# EAGLE design avrkitOnly (EAGLE 9.3.0)
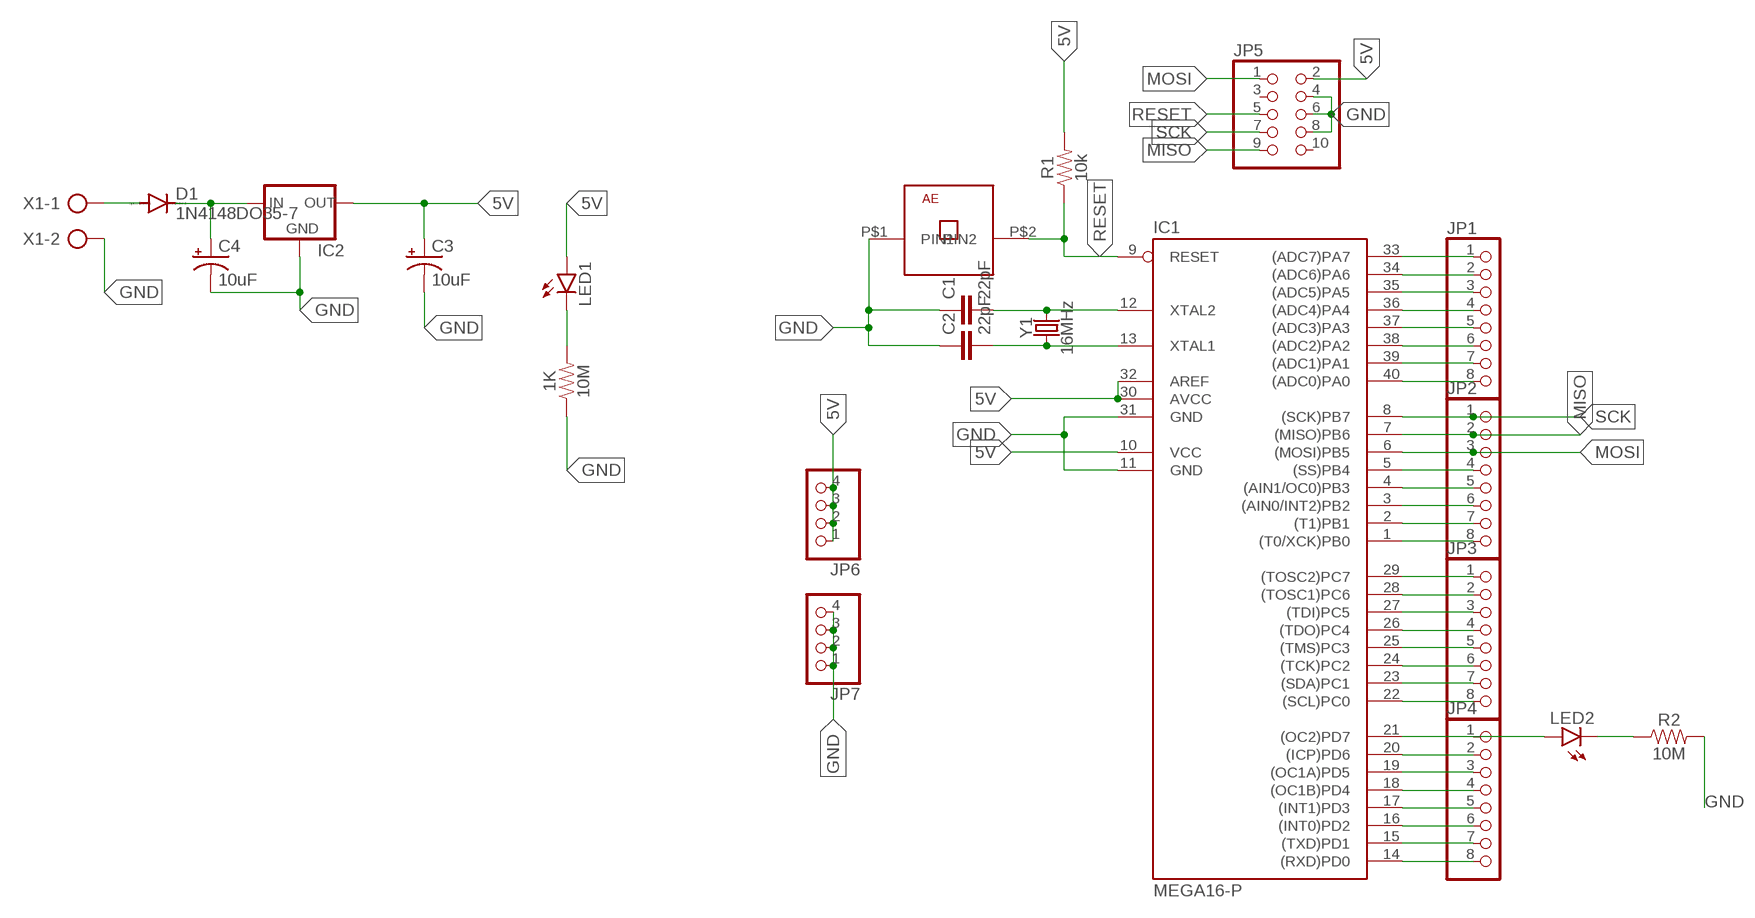
[diagram p0: schematic, sheet 1]

## Parts
1K  10M  10MOHM-HORIZ-1/4W-5%  [AXIAL-0.3]
C1  22pF  22PF-PTH-2.54MM-200V-5%  [CAP-PTH-2.54]
C2  22pF  22PF-PTH-2.54MM-200V-5%  [CAP-PTH-2.54]
C3  10uF  10UF-POLAR-RADIAL-2.5MM-25V-20%  [CPOL-RADIAL-2.5MM-5MM]
C4  10uF  10UF-POLAR-RADIAL-2.5MM-25V-20%  [CPOL-RADIAL-2.5MM-5MM]
D1  1N4148DO35-7  [DO35-7]
IC1  MEGA16-P  [DIL40]
IC2  78XXS  [78XXS]
JP1  PINHD-1X8  [1X08]
JP2  PINHD-1X8  [1X08]
JP3  PINHD-1X8  [1X08]
JP4  PINHD-1X8  [1X08]
JP5  PINHD-2X5  [2X05]
JP6  PINHD-1X4  [1X04]
JP7  PINHD-1X4  [1X04]
LED1  LED3MM  [LED3MM]
LED2  LED3MM  [LED3MM]
R1  10k  10MOHM-HORIZ-1/4W-5%  [AXIAL-0.3]
R2  10M  10MOHM-HORIZ-1/4W-5%  [AXIAL-0.3]
U$1  PUSHBUTTON-AE  [PUSHBUTTON-AE]
X1  AK500/2-H  [AK500/2-H]
Y1  16MHz  CRYSTAL-16MHZPTH-HC49US  [HC49US]

## Nets
5V: C3.1(+) IC1.10(VCC) IC1.30(AVCC) IC1.32(AREF) IC2.OUT JP5.2 JP6.1 JP6.2 JP6.3 JP6.4 LED1.A R1.P$2
GND: 1K.P$1 C1.1 C2.1 C3.2(-) C4.2(-) IC1.11(GND) IC1.31(GND) IC2.GND JP5.4 JP5.6 JP5.8 JP7.1 JP7.2 JP7.3 JP7.4 R2.P$2 U$1.P$1(PIN1) X1.2
MISO: IC1.7((MISO)PB6) JP2.2 JP5.9
MOSI: IC1.6((MOSI)PB5) JP2.3 JP5.1
N$1: C1.2 IC1.12(XTAL2) Y1.2
N$2: C2.2 IC1.13(XTAL1) Y1.1
N$3: C4.1(+) D1.C IC2.IN
N$4: 1K.P$2 LED1.K(C)
N$5: LED2.K(C) R2.P$1
N$6: D1.A X1.1
N$7: IC1.33((ADC7)PA7) JP1.1
N$8: IC1.34((ADC6)PA6) JP1.2
N$9: IC1.35((ADC5)PA5) JP1.3
N$10: IC1.36((ADC4)PA4) JP1.4
N$11: IC1.37((ADC3)PA3) JP1.5
N$12: IC1.38((ADC2)PA2) JP1.6
N$13: IC1.39((ADC1)PA1) JP1.7
N$14: IC1.40((ADC0)PA0) JP1.8
N$18: IC1.5((SS)PB4) JP2.4
N$19: IC1.4((AIN1/OC0)PB3) JP2.5
N$20: IC1.3((AIN0/INT2)PB2) JP2.6
N$21: IC1.2((T1)PB1) JP2.7
N$22: IC1.1((T0/XCK)PB0) JP2.8
N$23: IC1.29((TOSC2)PC7) JP3.1
N$24: IC1.28((TOSC1)PC6) JP3.2
N$25: IC1.27((TDI)PC5) JP3.3
N$26: IC1.26((TDO)PC4) JP3.4
N$27: IC1.25((TMS)PC3) JP3.5
N$28: IC1.24((TCK)PC2) JP3.6
N$29: IC1.23((SDA)PC1) JP3.7
N$30: IC1.22((SCL)PC0) JP3.8
N$31: IC1.21((OC2)PD7) JP4.1 LED2.A
N$32: IC1.20((ICP)PD6) JP4.2
N$33: IC1.19((OC1A)PD5) JP4.3
N$34: IC1.18((OC1B)PD4) JP4.4
N$35: IC1.17((INT1)PD3) JP4.5
N$36: IC1.16((INT0)PD2) JP4.6
N$37: IC1.15((TXD)PD1) JP4.7
N$38: IC1.14((RXD)PD0) JP4.8
RESET: IC1.9(RESET) JP5.5 R1.P$1 U$1.P$2(PIN2)
SCK: IC1.8((SCK)PB7) JP2.1 JP5.7
Unconnected: JP5.3 JP5.10

## Library data of the parts
1K R2 = SparkFun-Resistors:10MOHM: RES-09327; PROD_ID: RES-09327
C1 C2 = SparkFun-Capacitors:22PF: 22pF ceramic capacitors A capacitor is a passive two-terminal electrical component used to store electrical energy temporarily in an electric field.; PROD_ID: CAP-09128
C3 C4 = SparkFun-Capacitors:10UF-POLAR: 10.0µF polarized capacitors A capacitor is a passive two-terminal electrical component used to store electrical energy temporarily in an electric field.; PROD_ID: CAP-08440
D1 = diode:1N4148: DIODE high speed (Philips)
IC1 = atmel:MEGA16-P: MICROCONTROLLER 16 Kbytes FLASH 1 kbytes SRAM 512 bytes EEPROM USART 8-channel 10 bit ADC Source: avr.lbr; MPN: ATMEGA16-16PU; OC_FARNELL: 9171142; OC_NEWARK: 01M6885
IC2 = v-reg:78XXS: VOLTAGE REGULATOR
JP1-JP4 = pinhead:PINHD-1X8: PIN HEADER
JP5 = pinhead:PINHD-2X5: PIN HEADER
JP6 JP7 = pinhead:PINHD-1X4: PIN HEADER
LED1 LED2 = led:LED: LED OSRAM: - CHIPLED LG R971, LG N971, LY N971, LG Q971, LY Q971, LO R971, LY R971 LH N974, LH R974 LS Q976, LO Q976, LY Q976 LO Q996 - Hyper CHIPLED LW Q18S LB Q993, LB Q99A, LB R99A - SideLED LS A670, LO A670, LY A670, LG A670, LP A670 LB A673, LV A673, LT A673, LW A673 LH A674 LY A675 LS A676, LA A676, LO A676, LY A676, LW A676 LS A679, LY A679, LG A679 - Hyper Micro SIDELED® LS Y876, LA Y876, LO Y876, LY Y876 LT Y87S - SmartLED LW L88C, LW L88S LB L89C, LB L89S, LG L890 LS L89K, LO L89K, LY L89K LS L896, LA L896, LO L896, LY L896 - TOPLED LS T670, LO T670, LY T670, LG T670, LP T670 LSG T670, LSP T670, LSY T670, LOP T670, LYG T670 LG T671, LOG T671, LSG T671 LB T673, LV T673, LT T673, LW T673 LH T674 LS T676, LA T676, LO T676, LY T676, LB T676, LH T676, LSB T676, LW T676 LB T67C, LV T67C, LT T67C, LS T67K, LO T67K, LY T67K, LW E67C LS E67B, LA E67B, LO E67B, LY E67B, LB E67C, LV E67C, LT E67C LW T67C LS T679, LY T679, LG T679 LS T770, LO T770, LY T770, LG T770, LP T770 LB T773, LV T773, LT T773, LW T773 LH T774 LS E675, LA E675, LY E675, LS T675 LS T776, LA T776, LO T776, LY T776, LB T776 LHGB T686 LT T68C, LB T68C - Hyper Mini TOPLED® LB M676 - Mini TOPLED Santana® LG M470 LS M47K, LO M47K, LY M47K Source: http://www.osram.convergy.de LUXEON: - LUMILED® LXK2-PW12-R00, LXK2-PW12-S00, LXK2-PW14-U00, LXK2-PW14-V00 LXK2-PM12-R00, LXK2-PM12-S00, LXK2-PM14-U00 LXK2-PE12-Q00, LXK2-PE12-R00, LXK2-PE12-S00, LXK2-PE14-T00, LXK2-PE14-U00 LXK2-PB12-K00, LXK2-PB12-L00, LXK2-PB12-M00, LXK2-PB14-N00, LXK2-PB14-P00, LXK2-PB14-Q00 LXK2-PR12-L00, LXK2-PR12-M00, LXK2-PR14-Q00, LXK2-PR14-R00 LXK2-PD12-Q00, LXK2-PD12-R00, LXK2-PD12-S00 LXK2-PH12-R00, LXK2-PH12-S00 LXK2-PL12-P00, LXK2-PL12-Q00, LXK2-PL12-R00 Source: www.luxeon.com KINGBRIGHT: KA-3528ASYC Source: www.kingbright.com
R1 = SparkFun-Resistors:10MOHM: RES-09327; PROD_ID: RES-09327; VALUE: 10M
U$1 = PushButton-AE:PUSHBUTTON-AE: This is 2 pin push button designed by the one and only Alaa Essam وماعندناش داتا شيت ان كان عاجبك
X1 = con-ptr500:AK500/2-H: CONNECTOR Aug. 2004 / PTR Meßtechnik: Die Bezeichnung der Serie AK505 wurde geändert. Es handelt sich hierbei um AK500 in horizontaler Ausführung.; OC_FARNELL: unknown; OC_NEWARK: unknown
Y1 = SparkFun-Clocks:CRYSTAL-16MHZ: 16MHz Crystal Digikey Example <http://www.digikey.com/product-search/en?keywords=535-9122-1-ND> Frequency: 16MHz Frequency Stability: ±50ppm Frequency Tolerance: ±20ppm Load Capacitance: 18pF SparkFun Products: Pro Micro -5V/16MHz <https://www.sparkfun.com/products/12640> SparkFun Serial Enabled LCD Kit <https://www.sparkfun.com/products/10097>; PROD_ID: XTAL-08181; SF_ID: COM-00536

## Board
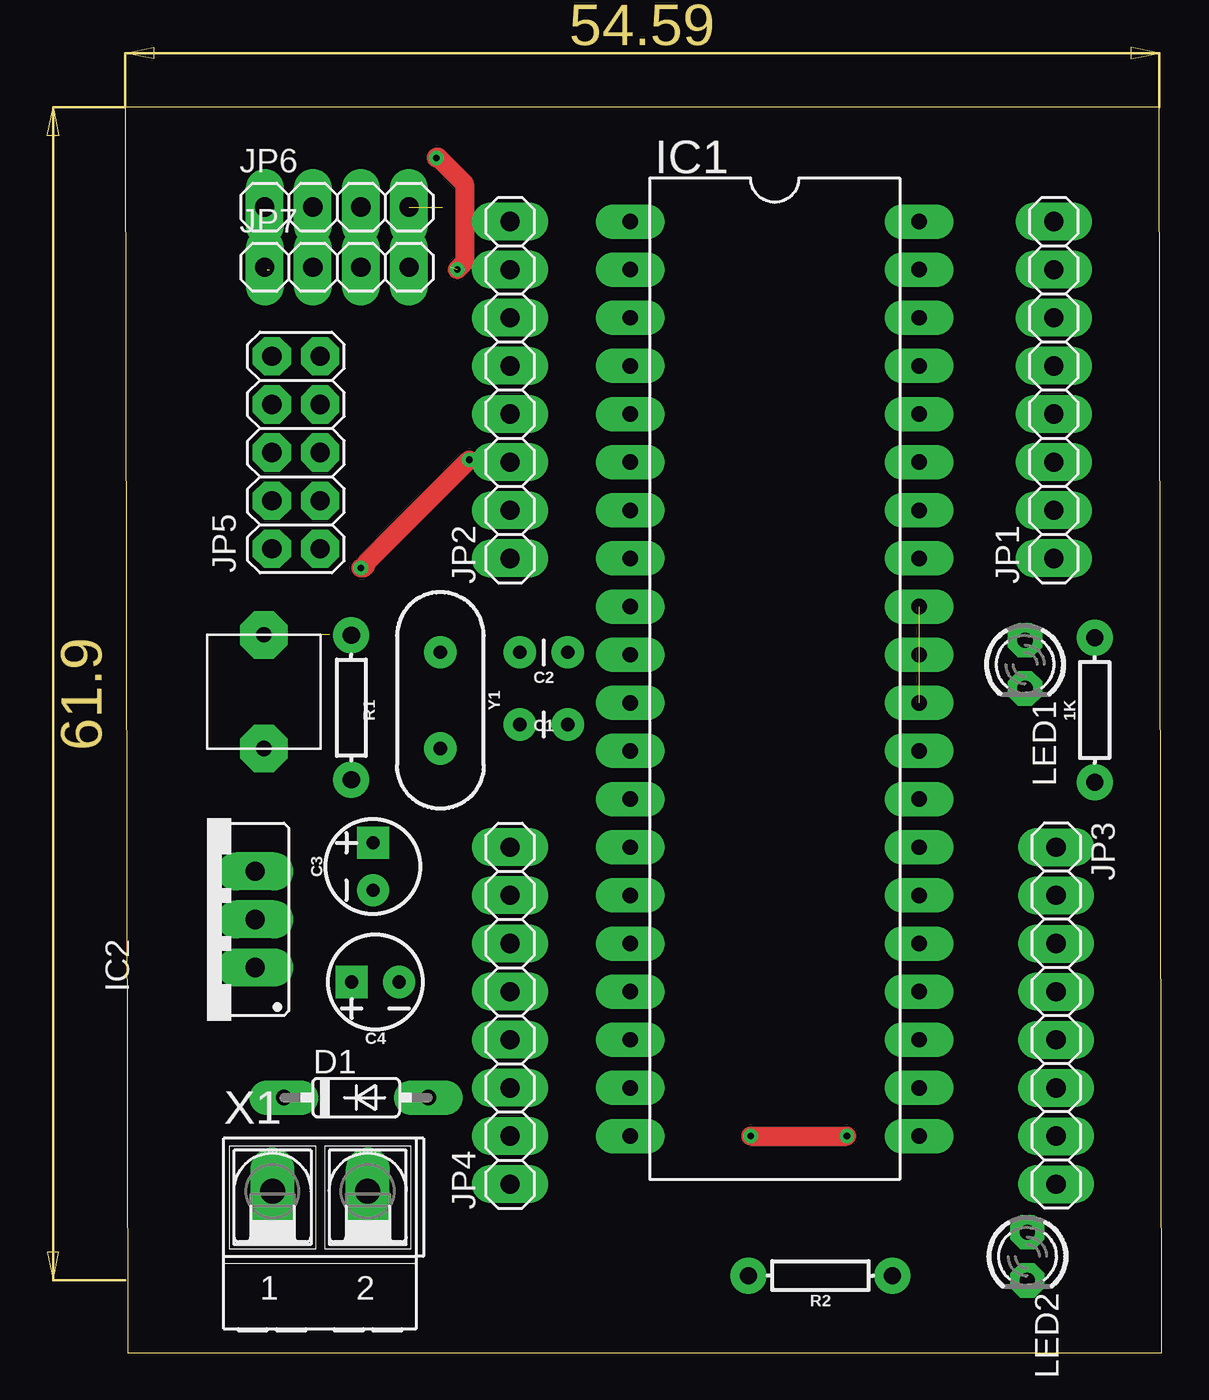
[diagram p1: board, top side]
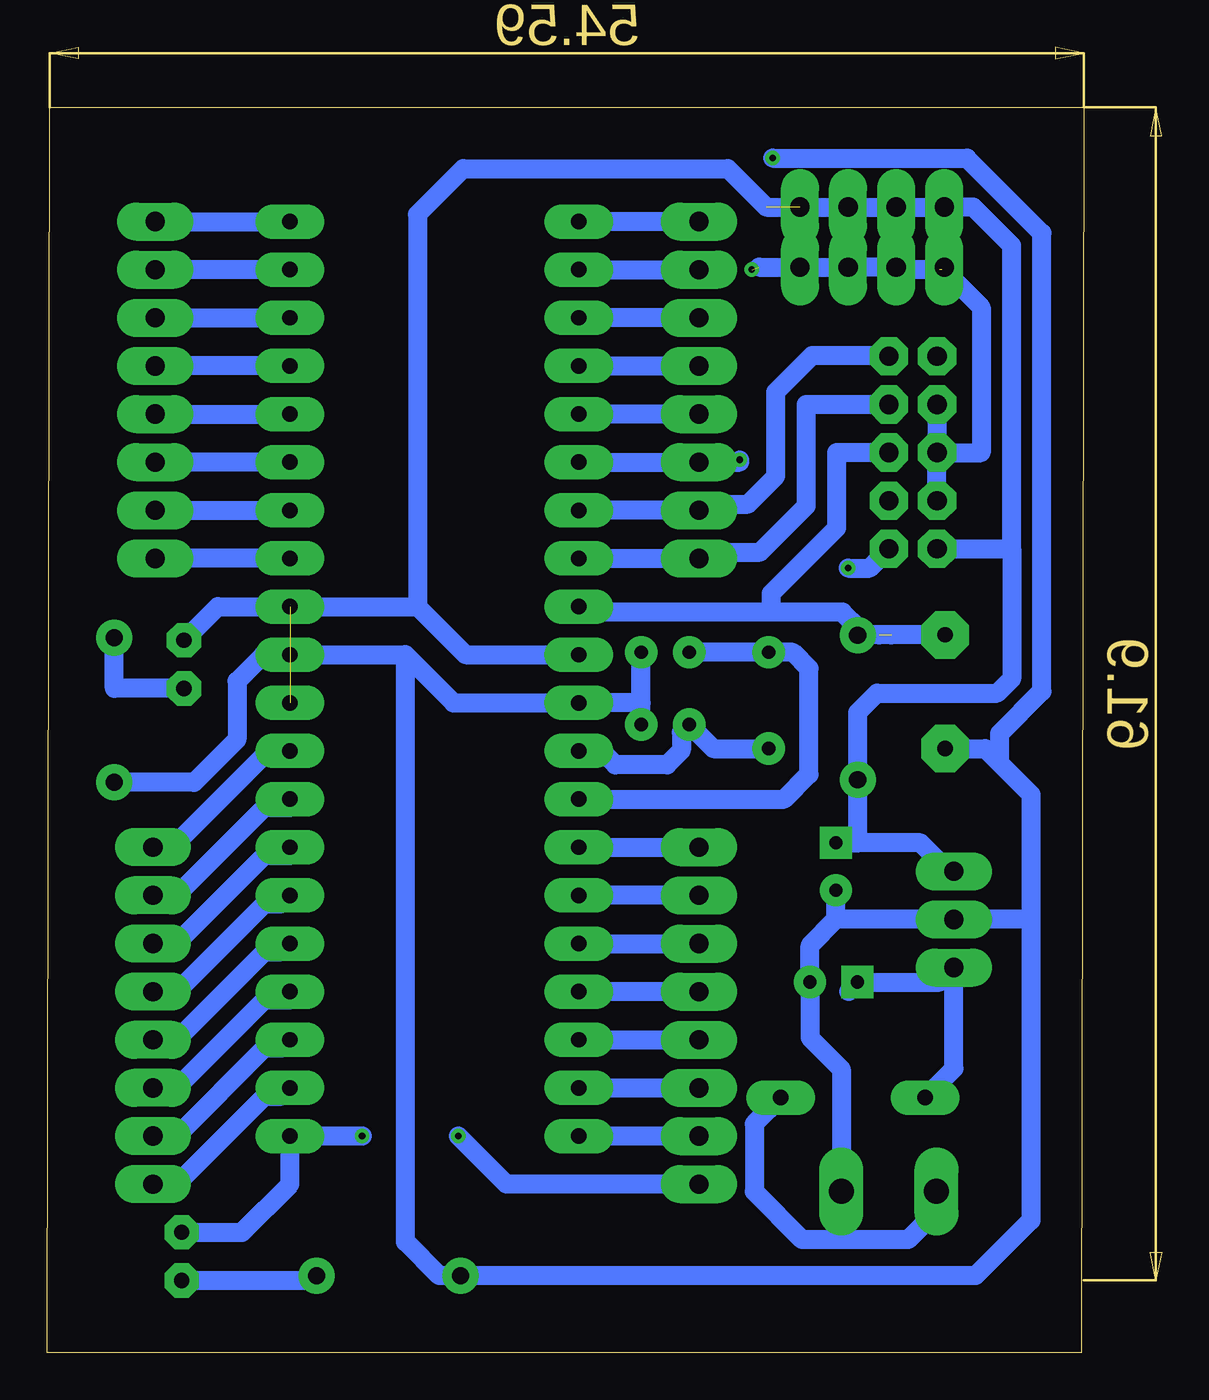
[diagram p2: board, bottom side, seen from below]

Size 54.72 x 65.71 mm. Coordinates in mm from the lower left corner, seen from the top.
Outline: 0.13,0 54.72,0 54.59,65.71 0,65.71 0.13,0
Copper layers (1*16): Top 0.035mm / dielectric 1.5mm / Bottom 0.035mm
Design rules "default *": minimum track width 1mm, minimum drill 0.35mm, track to track 0.6mm, track to pad 0.8mm, pad to pad 6mil, via to via 6mil, smd to smd 6mil, copper to edge 40mil, drill to drill 6mil, minimum pad ring 0.5mm, minimum via ring 8mil, stop-mask expansion 4mil, vias tented up to drill 0mil, thermal gap 10mil

### Footprints (pad centres in the part's own frame; a part is rotated, then mirrored left to right if it is on the bottom)
AXIAL-0.3 = drill 0.9 pad 1.88: P$1 -3.81,0; P$2 3.81,0
CAP-PTH-2.54 = drill 0.7 pad 1.651: 1 -1.27,0; 2 1.27,0
CPOL-RADIAL-2.5MM-5MM = drill 0.7 pad 1.651 square: 1 1.25,0 | drill 0.7 pad 1.651: 2 -1.25,0
DO35-7 = drill 0.813 long: A 3.81,0; C -3.81,0
DIL40 = drill 0.813 long: 1 -24.13,-7.62; 2 -21.59,-7.62; 3 -19.05,-7.62; 4 -16.51,-7.62; 5 -13.97,-7.62; 6 -11.43,-7.62; 7 -8.89,-7.62; 8 -6.35,-7.62; 9 -3.81,-7.62; 10 -1.27,-7.62; 11 1.27,-7.62; 12 3.81,-7.62; 13 6.35,-7.62; 14 8.89,-7.62; 15 11.43,-7.62; 16 13.97,-7.62; 17 16.51,-7.62; 18 19.05,-7.62; 19 21.59,-7.62; 20 24.13,-7.62; 21 24.13,7.62; 22 21.59,7.62; 23 19.05,7.62; 24 16.51,7.62; 25 13.97,7.62; 26 11.43,7.62; 27 8.89,7.62; 28 6.35,7.62; 29 3.81,7.62; 30 1.27,7.62; 31 -1.27,7.62; 32 -3.81,7.62; 33 -6.35,7.62; 34 -8.89,7.62; 35 -11.43,7.62; 36 -13.97,7.62; 37 -16.51,7.62; 38 -19.05,7.62; 39 -21.59,7.62; 40 -24.13,7.62
78XXS = drill 1.016 long: GND 0,-2.54; IN -2.54,-2.54; OUT 2.54,-2.54
1X08 = drill 1.016 long: 1 -8.89,0; 2 -6.35,0; 3 -3.81,0; 4 -1.27,0; 5 1.27,0; 6 3.81,0; 7 6.35,0; 8 8.89,0
2X05 = drill 1.016 octagon: 1 -5.08,-1.27; 2 -5.08,1.27; 3 -2.54,-1.27; 4 -2.54,1.27; 5 0,-1.27; 6 0,1.27; 7 2.54,-1.27; 8 2.54,1.27; 9 5.08,-1.27; 10 5.08,1.27
1X04 = drill 1.016 long: 1 -3.81,0; 2 -1.27,0; 3 1.27,0; 4 3.81,0
LED3MM = drill 0.813 octagon: A -1.27,0; K 1.27,0
PUSHBUTTON-AE = drill 0.8 pad 2.5 octagon: P$1 -3,0; P$2 -3,-6
AK500/2-H = drill 1.321 long: 1 -2.515,0; 2 2.515,0
HC49US = drill 0.7 pad 1.651: 1 -2.54,0; 2 2.54,0

### Placement (x,y rotation side)
1K  51.18,33.91 90 top
C1  22.1,33.15 180 top
C2  22.1,36.96 180 top
C3  13.08,25.65 90 top
C4  13.21,19.56 180 top
D1  12.19,13.46 0 top
IC1  34.29,35.56 270 top
IC2  4.32,22.86 90 top
JP1  49.02,50.8 90 top
JP2  20.32,50.8 90 top
JP3  49.15,17.78 270 top
JP4  20.32,17.78 90 top
JP5  9.02,47.5 90 top
JP6  11.18,60.45 0 top
JP7  11.18,57.28 0 top
LED1  47.5,36.32 270 top
LED2  47.63,5.08 270 top
R1  11.94,34.04 270 top
R2  36.7,4.06 180 top
U$1  4.32,31.88 180 top
X1  10.29,8.51 0 top
Y1  16.64,34.42 270 top

### Tracks (layer width: path | path; a pad name or v marks a point on that pad's centre or on a via)
5V  (2 unrouted)
  Bottom 1: IC2.OUT 7.11,25.4 8.62,26.9 C3.1 11.94,26.9 R1.P$2 11.94,33.78 10.92,34.8 4.57,34.8 3.81,35.56 3.81,42.42 | 35.18,39.37 IC1.32 45.72,39.37 LED1.A | IC1.10 32.64,36.83 35.18,39.37 | 35.18,39.37 35.18,60.07 32.77,62.48 18.8,62.48 16.76,60.45 JP6.3 JP6.2 JP6.1 5.84,60.45 3.81,58.42 3.81,42.42 | JP5.2 3.81,42.42
GND  (via drill 0.35)  (2 unrouted)
  Top 1: v16.43,63.04 arc-90 16.5,63.1 17.91,61.69 17.91,57.53 v17.53,57.15
  Bottom 1: 12.8,9.3 X1.2 12.8,14.96 14.46,16.62 C4.2 14.46,21.48 13.08,22.86 | 13.08,22.86 C3.2 | 13.08,22.86 IC2.GND 2.79,22.86 | U$1.P$1 5.21,31.88 4.45,31.11 | 4.45,31.11 2.79,29.46 2.79,22.86 | C1.1 23.37,34.29 | 23.37,34.29 C2.1 | 23.37,34.29 IC1.11 33.27,34.29 35.81,36.83 | 35.81,36.83 IC1.31 43.31,36.83 44.7,35.43 44.7,32.36 46.97,30.1 1K.P$1 | 2.79,22.86 2.79,6.99 5.72,4.06 R2.P$2 34.04,4.06 35.81,5.84 35.81,36.83 | JP5.4 JP5.6 | JP5.6 7.37,47.5 | 1K.P$1 50.93,30.35 | 7.49,57.15 JP7.1 7.37,57.12 5.41,55.16 5.41,47.5 JP5.6 | 7.62,57.15 10.03,57.15 JP7.2 JP7.3 JP7.4 17.15,57.28 | JP5.8 JP5.6 | 1K.P$1 51.18,30.35 | 4.45,31.11 4.45,32.66 2.21,34.9 2.21,59.08 6.17,63.04 v16.43,63.04
MISO
  Bottom 1: IC1.7 JP2.2 19.99,44.78 17.73,44.78 16.26,46.26 16.26,50.7 14.33,52.63 10.34,52.63 JP5.9
MOSI  (via drill 0.35)
  Top 1: v18.16,47.12 12.7,41.66 12.7,41.53 12.57,41.4 v12.45,41.4
  Bottom 1: IC1.6 JP2.3 | JP2.3 19.99,47.32 | JP2.3 18.16,46.99 v18.16,47.12 | v12.45,41.4 11.3,41.4 JP5.1
N$1
  Bottom 1: Y1.2 19.56,31.88 C1.2 21.24,32.73 21.24,31.78 22,31.02 24.73,31.02 25.46,31.75 IC1.12
N$2
  Bottom 1: C2.2 Y1.1 15.37,36.96 14.51,36.1 14.51,30.51 15.82,29.21 IC1.13
N$3
  Bottom 1: D1.C 6.86,14.99 IC2.IN 7.62,19.56 C4.1 12.4,19.05
N$4
  Bottom 1: LED1.K 51.18,35.05 1K.P$2
N$5
  Bottom 1: LED2.K 40.77,3.81 R2.P$1
N$6
  Bottom 1: D1.A 17.4,12.06 17.4,8.51 14.86,5.97 9.27,5.97 7.77,7.47 X1.1
N$7
  Bottom 1: IC1.33 JP1.1
N$8
  Bottom 1: JP1.2 IC1.34
N$9
  Bottom 1: IC1.35 JP1.3
N$10
  Bottom 1: JP1.4 IC1.36
N$11
  Bottom 1: IC1.37 JP1.5
N$12
  Bottom 1: JP1.6 IC1.38
N$13
  Bottom 1: IC1.39 JP1.7
N$14
  Bottom 1: JP1.8 IC1.40
N$18
  Bottom 1: JP2.4 IC1.5
N$19
  Bottom 1: IC1.4 JP2.5
N$20
  Bottom 1: JP2.6 IC1.3
N$21
  Bottom 1: IC1.2 JP2.7
N$22
  Bottom 1: JP2.8 IC1.1
N$23
  Bottom 1: JP3.1 48.13,26.67 42.93,31.88 42.04,31.88 IC1.29
N$24
  Bottom 1: JP3.2 47.9,24.13 43.26,28.78 41.91,28.78 IC1.28
N$25
  Bottom 1: JP3.3 48.82,21.92 47.57,21.92 43.26,26.24 41.91,26.24 IC1.27
N$26
  Bottom 1: IC1.26 42.34,23.7 43.26,23.7 47.9,19.05 JP3.4
N$27
  Bottom 1: IC1.25 42.34,21.16 43.26,21.16 47.9,16.51 JP3.5
N$28
  Bottom 1: JP3.6 48.82,14.3 47.57,14.3 43.26,18.62 41.91,18.62 IC1.24
N$29
  Bottom 1: JP3.7 47.9,11.43 43.26,16.08 42.34,16.08 IC1.23
N$30
  Bottom 1: JP3.8 47.9,8.89 43.26,13.54 42.34,13.54 IC1.22
N$31  (via drill 0.35)
  Top 1: v33.02,11.43 v38.1,11.43
  Bottom 1: JP4.1 30.48,8.89 v33.02,11.43 | v38.1,11.43 IC1.21 41.91,8.89 44.45,6.35 LED2.A
N$32
  Bottom 1: JP4.2 IC1.20
N$33
  Bottom 1: IC1.19 JP4.3
N$34
  Bottom 1: IC1.18 JP4.4
N$35
  Bottom 1: JP4.5 IC1.17
N$36
  Bottom 1: IC1.16 JP4.6
N$37
  Bottom 1: JP4.7 IC1.15
N$38
  Bottom 1: IC1.14 JP4.8
RESET  (1 unrouted)
  Bottom 1: IC1.9 26.38,39.08 16.51,39.08 | 16.51,39.08 12.73,39.08 11.94,38.29 R1.P$1 11.91,37.88 10.16,37.88 | U$1.P$2 10.8,37.88 | JP5.5 13.06,47.5 13.06,43.51 16.51,40.06 16.51,39.08
SCK
  Bottom 1: IC1.8 JP2.1 | JP2.1 20.27,41.86 | JP2.1 19.99,42.24 17.1,42.24 14.66,44.68 14.66,50.04 JP5.7